# EAGLE design fc_rocket (EAGLE 9.2.2)
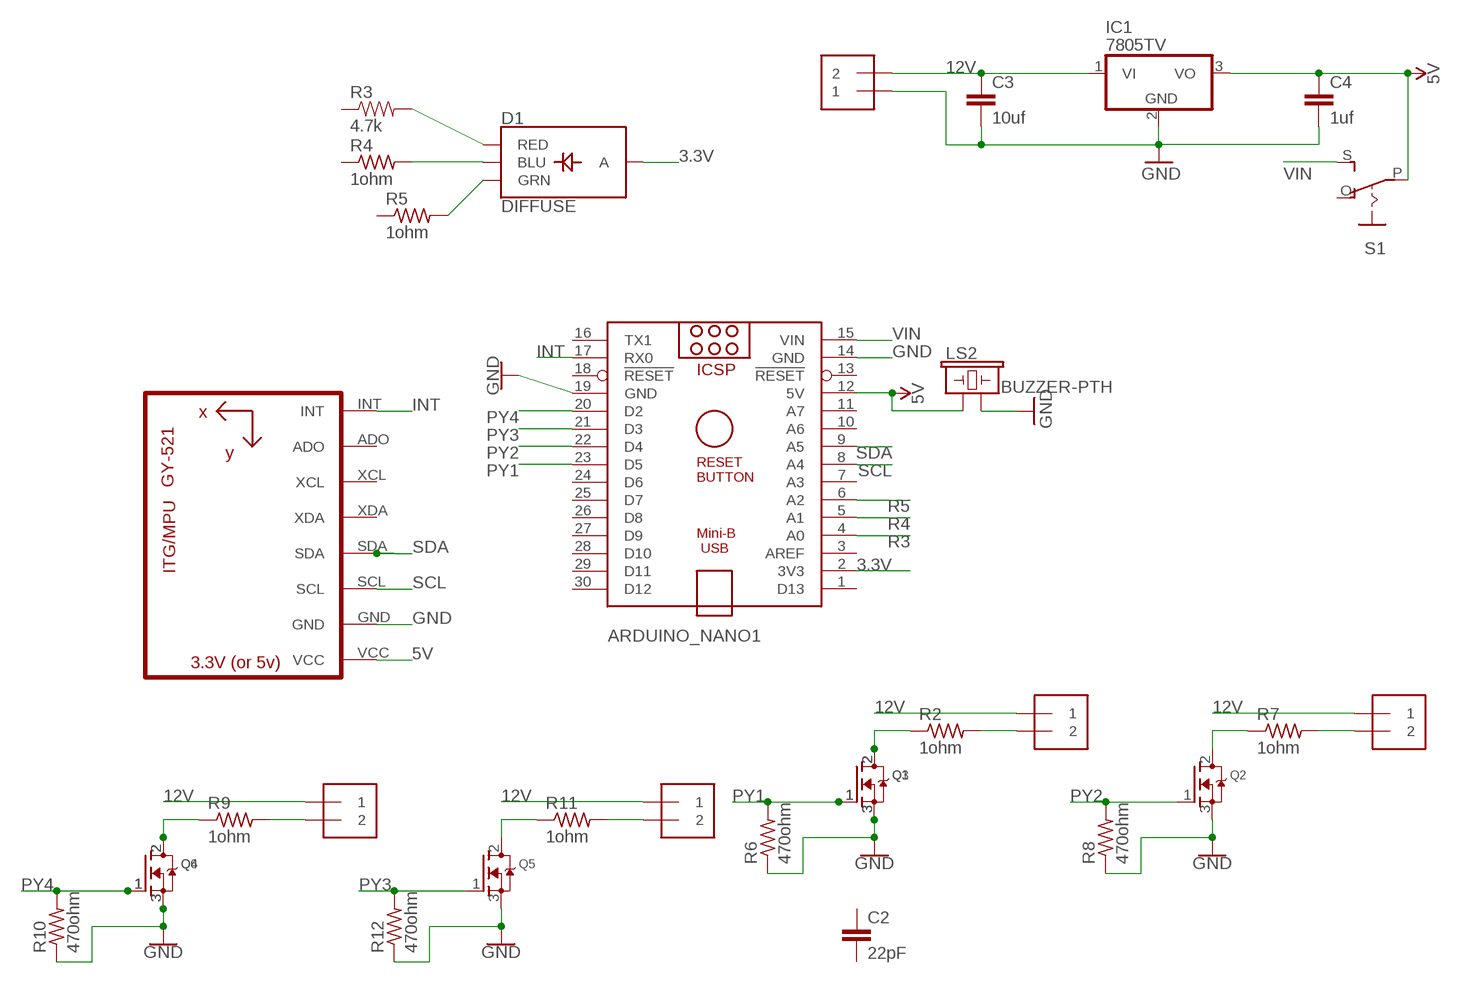
[diagram p0: schematic, sheet 1]

## Parts
ARDUINO_NANO1  ARDUINO_NANO  [ARDUINO_NANO]
C2  22pF  22PF-PTH-2.54MM-200V-5%  [CAP-PTH-2.54]
C3  10uf  22PF-PTH-2.54MM-200V-5%  [CAP-PTH-2.54]
C4  1uf  22PF-PTH-2.54MM-200V-5%  [CAP-PTH-2.54]
D1  DIFFUSE  LED-RGB-CADIFFUSE  [LED-RGB-THRU]
IC1  7805TV  [TO220V]
J2  1X2-3.5MM  [1X2-3.5MM]
J3  1X2-3.5MM  [1X2-3.5MM]
J4  1X2-3.5MM  [1X2-3.5MM]
J5  1X2-3.5MM  [1X2-3.5MM]
J6  1X2-3.5MM  [1X2-3.5MM]
LS2  BUZZER-PTH  [BUZZER-12MM]
Q1  MOSFET-NGDS_TO220V  [TO220V]
Q2  MOSFET-NGDS_TO220V  [TO220V]
Q3  MOSFET-NGDS_TO220V  [TO220V]
Q4  MOSFET-NGDS_TO220V  [TO220V]
Q5  MOSFET-NGDS_TO220V  [TO220V]
Q6  MOSFET-NGDS_TO220V  [TO220V]
R2  1ohm  FLIPFLOP-RES  [0805-THM]
R3  4.7k  4.7KOHM-0603-1/10W-1%  [0603]
R4  1ohm  FLIPFLOP-RES  [0805-THM]
R5  1ohm  FLIPFLOP-RES  [0805-THM]
R6  470ohm  FLIPFLOP-RES  [0805-THM]
R7  1ohm  FLIPFLOP-RES  [0805-THM]
R8  470ohm  FLIPFLOP-RES  [0805-THM]
R9  1ohm  FLIPFLOP-RES  [0805-THM]
R10  470ohm  FLIPFLOP-RES  [0805-THM]
R11  1ohm  FLIPFLOP-RES  [0805-THM]
R12  470ohm  FLIPFLOP-RES  [0805-THM]
S1  EG1218S  [EG1218]
U2  GY-521MPU6050  [GY-521]

## Nets
3.3V: ARDUINO_NANO1.2(3V3) D1.2(A)
5V: ARDUINO_NANO1.12(5V) C4.1 IC1.3(VO) LS2.+ S1.P U2.VCC
12V: C3.1 IC1.1(VI) J2.2 J3.1 J4.1 J5.1 J6.1
GND: ARDUINO_NANO1.14(GND) ARDUINO_NANO1.19(GND) C3.2 C4.2 IC1.2(GND) J2.1 LS2.- Q1.3(S) Q2.3(S) Q3.3(S) Q4.3(S) Q5.3(S) Q6.3(S) R6.1 R8.1 R10.1 R12.1 U2.GND
INT: ARDUINO_NANO1.17(RX0) U2.INT
N$2: D1.1(RED) R3.2
N$3: D1.4(BLU) R4.2
N$4: D1.3(GRN) R5.2
N$6: J3.2 R2.2
N$7: Q1.2(D) Q3.2(D) R2.1
N$8: J4.2 R7.2
N$9: Q2.2(D) R7.1
N$10: J5.2 R9.2
N$11: Q4.2(D) Q6.2(D) R9.1
N$12: J6.2 R11.2
N$13: Q5.2(D) R11.1
PY1: ARDUINO_NANO1.23(D5) Q1.1(G) Q3.1(G) R6.2
PY2: ARDUINO_NANO1.22(D4) Q2.1(G) R8.2
PY3: ARDUINO_NANO1.21(D3) Q5.1(G) R12.2
PY4: ARDUINO_NANO1.20(D2) Q4.1(G) Q6.1(G) R10.2
R3: ARDUINO_NANO1.4(A0)
R4: ARDUINO_NANO1.5(A1)
R5: ARDUINO_NANO1.6(A2)
SCL: ARDUINO_NANO1.8(A4) U2.SCL
SDA: ARDUINO_NANO1.9(A5) U2.SDA
VIN: ARDUINO_NANO1.15(VIN) S1.S
Unconnected: ARDUINO_NANO1.1(D13) ARDUINO_NANO1.3(AREF) ARDUINO_NANO1.7(A3) ARDUINO_NANO1.10(A6) ARDUINO_NANO1.11(A7) ARDUINO_NANO1.13(!RESET) ARDUINO_NANO1.16(TX1) ARDUINO_NANO1.18(!RESET) ARDUINO_NANO1.24(D6) ARDUINO_NANO1.25(D7) ARDUINO_NANO1.26(D8) ARDUINO_NANO1.27(D9) ARDUINO_NANO1.28(D10) ARDUINO_NANO1.29(D11) ARDUINO_NANO1.30(D12) C2.1 C2.2 R3.1 R4.1 R5.1 S1.O U2.ADO U2.XCL U2.XDA

## Library data of the parts
ARDUINO_NANO1 = ArduinoNanoV30:ARDUINO_NANO: Arduino Nano V3.0 Overview: The Arduino Nano is a small, complete, and breadboard-friendly board based on the ATmega328 (Arduino Nano 3.x) or ATmega168 (Arduino Nano 2.x). It has more or less the same functionality of the Arduino Duemilanove, but in a different package. It lacks only a DC power jack, and works with a Mini-B USB cable instead of a standard one. The Nano was designed and is being produced by Gravitech. Specifications: Microcontroller Atmel ATmega168 or ATmega328 Operating Voltage (logic level) 5 V Input Voltage (recommended) 7-12 V Input Voltage (limits) 6-20 V Digital I/O Pins 14 (of which 6 provide PWM output) Analog Input Pins 8 DC Current per I/O Pin 40 mA Flash Memory 16 KB (ATmega168) or 32 KB (ATmega328) of which 2 KB used by bootloader SRAM 1 KB (ATmega168) or 2 KB (ATmega328) EEPROM 512 bytes (ATmega168) or 1 KB (ATmega328) Clock Speed 16 MHz Dimensions 0.73" x 1.70" Length 45 mm Width 18 mm Weigth 5 g Power: The Arduino Nano can be powered via the Mini-B USB connection, 6-20V unregulated external power supply (pin 30), or 5V regulated external power supply (pin 27). The power source is automatically selected to the highest voltage source. Memory: The ATmega168 has 16 KB of flash memory for storing code (of which 2 KB is used for the bootloader); the ATmega328 has 32 KB, (also with 2 KB used for the bootloader). The ATmega168 has 1 KB of SRAM and 512 bytes of EEPROM (which can be read and written with the EEPROM library); the ATmega328 has 2 KB of SRAM and 1 KB of EEPROM. Input and Output: Each of the 14 digital pins on the Nano can be used as an input or output, using pinMode(), digitalWrite(), and digitalRead() functions. They operate at 5 volts. Each pin can provide or receive a maximum of 40 mA and has an internal pull-up resistor (disconnected by default) of 20-50 kOhms. In addition, some pins have specialized functions. Visit Arduino - ArduinoBoardNano <https://www.arduino.cc/en/Main/ArduinoBoardNano>
C2 = SparkFun-Capacitors:22PF: 22pF ceramic capacitors A capacitor is a passive two-terminal electrical component used to store electrical energy temporarily in an electric field.; PROD_ID: CAP-09128
C3 C4 = SparkFun-Capacitors:22PF: 22pF ceramic capacitors A capacitor is a passive two-terminal electrical component used to store electrical energy temporarily in an electric field.; PROD_ID: CAP-09128; VALUE: 22pF
D1 = SparkFun-LED:LED-RGB-CA: LED-RGB Diffused Common Anode Packages: LED RGB-THRU P-LCC-4-3 LED-TRICOLOR-SMD SparkFun Products: RGB Diffused Common Anode- Diffuse <[https://www.sparkfun.com/products/10821]> RGB Diffused Common Anode - Clear <[https://www.sparkfun.com/products/10820]> Qduino Mini <[https://www.sparkfun.com/products/13614]> Triple Output LED RGB - SMD <https://www.sparkfun.com/products/7844>; PROD_ID: DIO-10632
IC1 = linear:78*: Positive VOLTAGE REGULATOR Source: http://cache.national.com/ds/LM/LM78L05.pdf http://www.fairchildsemi.com/ds/LM/LM7805.pdf
J2-J6 = adafruit:1X2: 3.5mm Terminal block http://www.ladyada.net/library/pcb/eaglelibrary.html
LS2 = SparkFun-Electromechanical:BUZZER: Buzzer Small round buzzers that operate around the audible 2kHz range. You can use these as speakers to create simple music or user interfaces. Variant Overview: PTH - Mini Speaker - PC Mount 12mm 2.048kHz <https://www.sparkfun.com/products/7950> PTH_KIT - Mini Speaker - PC Mount 12mm 2.048kHz <https://www.sparkfun.com/products/7950> KIT simplifies soldering by adding stop mask to one side of the pads. PTH_NO_SILK - Mini Speaker - PC Mount 12mm 2.048kHz <https://www.sparkfun.com/products/7950> No silkscreen indicator of buzzer outline. PTH_KIT_NO_SILK - Mini Speaker - PC Mount 12mm 2.048kHz <https://www.sparkfun.com/products/7950> KIT package w/o silkscreen SMD - Buzzer Audio Magnetic (CCV-084B16) SMD buzzer used on, e.g. the LilyPad Buzzer <https://www.sparkfun.com/products/8463> and RFID USB Reader <https://www.sparkfun.com/products/9963>. SMD_KIT - Buzzer Audio Magnetic (CCV-084B16) SMD Buzzer with elongated pins to make soldering easier. Used on the SparkFun Simon Says - Surface Mount Soldering Kit <https://www.sparkfun.com/products/10935>.; PROD_ID: COMP-08253; SF_SKU: COM-07950
Q1-Q6 = adafruit:MOSFET-N: N-Channel Mosfet 2N7002E - 60V 260mA SOT23 [Digikey: 2N7002ET1GOSTR-ND] - REEL BSH103 - 30V 850mA SOT23 [Digikey: 568-5013-1-ND]
R2 R4-R12 = adafruit:FLIPFLOP-RES: Flip Flop resistor An 0805 resistor inside a standard 1/4W 5% resistor. Makes for easy mods
R3 = SparkFun-Resistors:4.7KOHM: 4.7kΩ resistor A resistor is a passive two-terminal electrical component that implements electrical resistance as a circuit element. Resistors act to reduce current flow, and, at the same time, act to lower voltage levels within circuits. - Wikipedia; PROD_ID: RES-07857
S1 = adafruit:EG1218: SLIDING SWITCH 0.1" spacing through hole, vertical SPDT slide switch http://www.ladyada.net/library/pcb/eaglelibrary.html
U2 = gy-521:GY-521

## Board
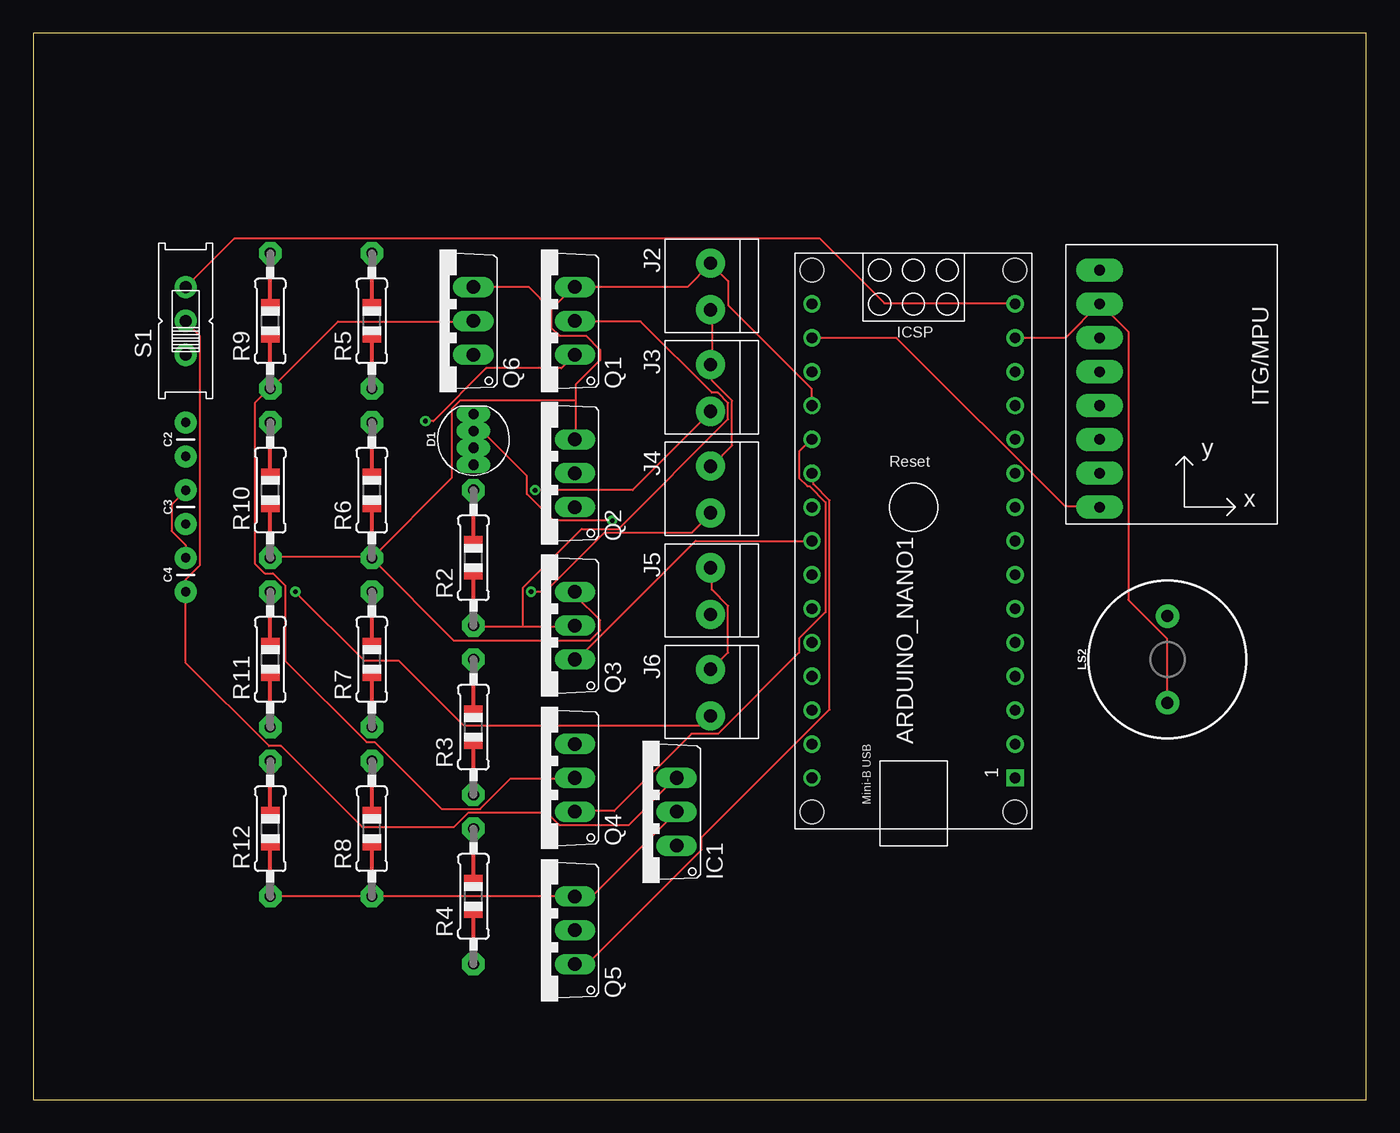
[diagram p1: board, top side]
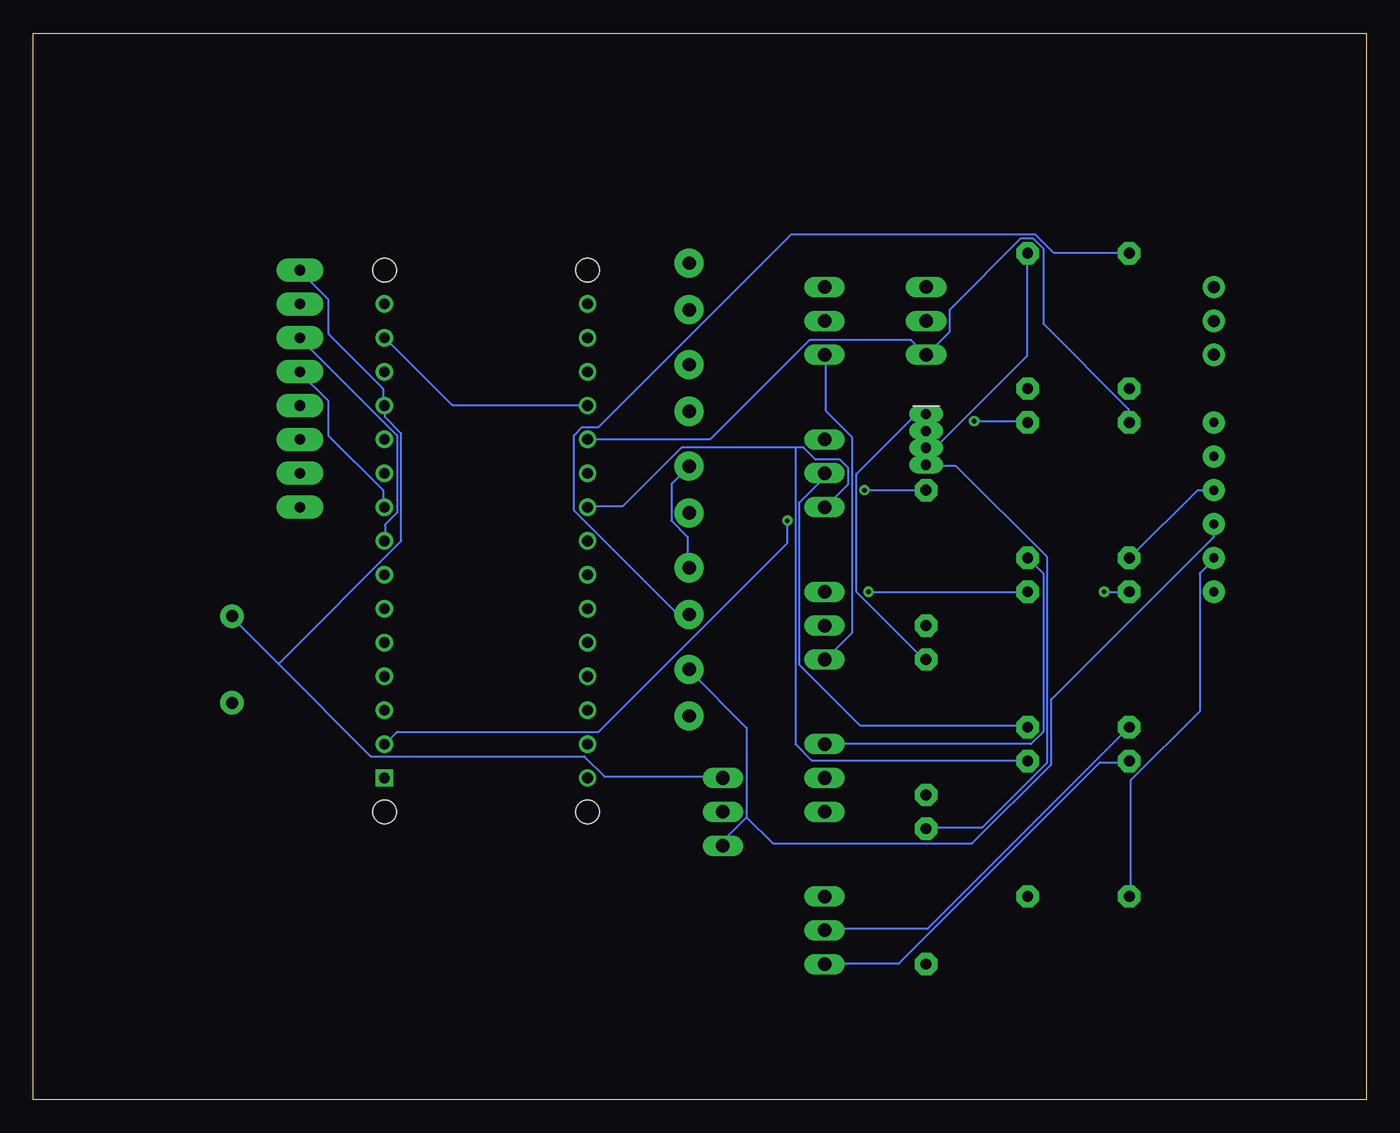
[diagram p2: board, bottom side, seen from below]

Size 100 x 80 mm. Coordinates in mm from the lower left corner, seen from the top.
Outline: 0,0 100,0 100,80 0,80 0,0
Copper layers (1*16): Top 0.035mm / dielectric 1.5mm / Bottom 0.035mm
Design rules "default": minimum track width 6mil, minimum drill 0.35mm, track to track 6mil, track to pad 6mil, pad to pad 6mil, via to via 6mil, smd to smd 6mil, copper to edge 40mil, drill to drill 6mil, minimum pad ring 10mil, minimum via ring 8mil, stop-mask expansion 4mil, vias tented up to drill 0mil, thermal gap 10mil

### Footprints (pad centres in the part's own frame; a part is rotated, then mirrored left to right if it is on the bottom)
ARDUINO_NANO = drill 0.8 square: 1 -20.32,-7.62 | drill 0.8: 2 -17.78,-7.62; 3 -15.24,-7.62; 4 -12.7,-7.62; 5 -10.16,-7.62; 6 -7.62,-7.62; 7 -5.08,-7.62; 8 -2.54,-7.62; 9 0,-7.62; 10 2.54,-7.62; 11 5.08,-7.62; 12 7.62,-7.62; 13 10.16,-7.62; 14 12.7,-7.62; 15 15.24,-7.62; 16 15.24,7.62; 17 12.7,7.62; 18 10.16,7.62; 19 7.62,7.62; 20 5.08,7.62; 21 2.54,7.62; 22 0,7.62; 23 -2.54,7.62; 24 -5.08,7.62; 25 -7.62,7.62; 26 -10.16,7.62; 27 -12.7,7.62; 28 -15.24,7.62; 29 -17.78,7.62; 30 -20.32,7.62 | hole 1.778: -22.86,-7.62; -22.86,7.62; 17.78,7.62; 17.78,-7.62
CAP-PTH-2.54 = drill 0.7 pad 1.651: 1 -1.27,0; 2 1.27,0
LED-RGB-THRU = drill 0.762 pad 0.889 long: 1 1.905,0; 2 0.635,0; 3 -0.635,0; 4 -1.905,0
TO220V = drill 1.016 long: 1 -2.54,-2.54; 2 0,-2.54; 3 2.54,-2.54
1X2-3.5MM = drill 1 pad 2.184: 1 1.8,0; 2 -1.7,0
BUZZER-12MM = drill 0.9 pad 1.778: + 3.25,0; - -3.25,0
0805-THM = drill 0.813 pad 1.676 octagon: 1 -5.08,0; 2 5.08,0
EG1218 = drill 0.9 pad 1.676: O -2.54,0; P 0,0; S 2.54,0
GY-521 = drill 0.8 pad 1.778 long: ADO -8.89,-6.35; GND -8.89,6.35; INT -8.89,-8.89; SCL -8.89,3.81; SDA -8.89,1.27; VCC -8.89,8.89; XCL -8.89,-3.81; XDA -8.89,-1.27

### Placement (x,y rotation side)
ARDUINO_NANO1  66.04,44.45 90 top
C2  11.43,49.53 90 top
C3  11.43,44.45 90 top
C4  11.43,39.37 90 top
D1  33.02,49.53 90 top
IC1  45.72,21.59 90 top
J2  50.8,60.96 90 top
J3  50.8,53.34 90 top
J4  50.8,45.72 90 top
J5  50.8,38.1 90 top
J6  50.8,30.48 90 top
LS2  85.09,33.02 90 top
Q1  38.1,58.42 90 top
Q2  38.1,46.99 90 top
Q3  38.1,35.56 90 top
Q4  38.1,24.13 90 top
Q5  38.1,12.7 90 top
Q6  30.48,58.42 90 top
R2  33.02,40.64 90 top
R3  40ohm  [0805-THM]  33.02,27.94 90 top
R4  33.02,15.24 90 top
R5  25.4,58.42 90 top
R6  25.4,45.72 90 top
R7  25.4,33.02 90 top
R8  25.4,20.32 90 top
R9  17.78,58.42 90 top
R10  17.78,45.72 90 top
R11  17.78,33.02 90 top
R12  17.78,20.32 90 top
S1  11.43,58.42 90 top
U2  88.9,53.34 0 top

### Tracks (layer width: path | path; a pad name or v marks a point on that pad's centre or on a via)
3.3V  (via drill 0.35)
  Top 0.152: v43.43,43.43 39.01,43.43 37.03,45.41 37.03,46.79 33.68,50.14 33.07,50.14 D1.2
  Bottom 0.152: v43.43,43.43 43.43,41.76 57.61,27.58 72.69,27.58 73.61,26.67 ARDUINO_NANO1.2
5V
  Top 0.152: S1.P 11.43,58.37 12.5,57.3 12.5,40.08 11.43,39.01 C4.1 11.43,32.77 17.68,26.52 18.59,26.52 24.69,20.42 31.55,20.42 32.61,21.49 38.56,21.49 39.47,20.57 44.65,20.57 48.16,24.08 IC1.3
  Bottom 0.152: U2.VCC 80.01,62.18 77.88,60.05 77.88,57.45 73.76,53.34 73.76,52.12 ARDUINO_NANO1.12 73.61,51.97 73.61,51.21 72.39,49.99 72.39,41.91 81.53,32.77 81.69,32.77 | 81.69,32.77 85.04,36.12 LS2.+ | 81.69,32.77 74.68,25.76 58.67,25.76 57.15,24.23 48.31,24.23 IC1.3
12V
  Top 0.152: J2.2 50.9,59.13 50.9,55.17 J3.1 50.9,55.02 50.9,53.95 52.43,52.43 52.43,49.07 50.9,47.55 J4.1 | J5.1 50.9,39.78 50.9,38.25 52.12,37.03 52.12,33.53 50.9,32.31 J6.1
  Bottom 0.152: J5.1 50.9,39.93 50.9,42.22 52.12,43.43 52.12,46.18 50.9,47.4 J4.1 | 46.48,21.18 48.16,19.51 48.16,19.05 IC1.1 | 46.48,21.18 46.48,27.89 50.75,32.16 J6.1 | C3.1 11.43,42.22 23.62,30.02 23.62,25.15 29.57,19.2 44.5,19.2 46.48,21.18
GND
  Top 0.152: R12.1 R8.1 Q5.3 41.91,15.24 IC1.2 | C4.2 11.43,41.6 10.36,42.67 10.36,44.65 C3.2 | Q3.3 40.69,38.1 40.69,37.8 42.52,35.97 42.52,35.2 41.76,34.44 31.55,34.44 25.45,40.54 R6.1 | R10.1 17.83,40.69 25.3,40.69 R6.1 | 40.69,52.43 40.69,53.65 42.52,55.47 42.52,56.24 41.45,57.3 39.47,57.3 38.86,57.91 38.86,59.28 | 40.69,52.43 40.69,49.53 Q2.3 | 38.86,59.28 40.54,60.96 Q1.3 49.07,60.96 50.75,62.64 J2.1 50.9,62.64 52.12,61.42 52.12,59.59 58.37,53.34 58.37,52.12 ARDUINO_NANO1.19 | Q6.3 37.19,60.96 38.86,59.28 | ARDUINO_NANO1.14 77.42,57.15 80.01,59.74 | 80.01,59.74 82.14,57.61 82.14,37.49 85.04,34.59 85.04,29.87 LS2.- | 80.01,59.74 U2.GND | R6.1 31.39,46.63 31.39,51.82 32,52.43 40.69,52.43
  Bottom 0.152: Q4.3 25.15,26.67 24.23,27.58 24.23,39.47 R6.1 | C3.2 12.65,45.72 17.68,40.69 R10.1 | R12.1 17.68,15.24 17.68,23.93 12.5,29.11 12.5,39.47 11.43,40.54 C4.2 | ARDUINO_NANO1.19 58.52,52.12 68.58,52.12 73.61,57.15 ARDUINO_NANO1.14
INT
  Top 0.152: ARDUINO_NANO1.17 64.77,57.15 77.42,44.5 80.01,44.5 U2.INT
N$2
  Bottom 0.152: D1.1 33.07,51.36 33.83,51.36 38.25,46.94 38.25,38.1 33.07,32.92 R3.2
N$3
  Bottom 0.152: D1.4 32.92,47.55 30.79,47.55 23.93,40.69 23.93,25.3 28.8,20.42 32.92,20.42 R4.2
N$4
  Bottom 0.152: D1.3 32.92,48.92 32.31,48.92 25.45,55.78 25.45,63.4 R5.2
N$6  (via drill 0.35)
  Top 0.152: v37.64,45.72 44.96,45.72 50.75,51.51 J3.2
  Bottom 0.152: v37.64,45.72 R2.2
N$7
  Top 0.152: 36.73,35.51 33.07,35.51 R2.1 | 36.73,35.51 40.54,35.51 Q3.2 | 36.73,35.51 36.73,38.41 41.15,42.82 43.89,42.82 52.12,51.05 52.12,52.27 51.36,53.03 50.9,53.03 45.57,58.37 40.69,58.37 Q1.2
N$8  (via drill 0.35)
  Top 0.152: v37.34,38.1 38.41,38.1 42.82,42.52 49.38,42.52 50.75,43.89 J4.2
  Bottom 0.152: v37.34,38.1 R7.2
N$9
  Bottom 0.152: Q2.2 40.69,46.94 40.69,46.63 42.52,44.81 42.52,32.61 37.95,28.04 25.45,28.04 R7.1
N$10
  Bottom 0.152: R9.2 17.83,63.55 23.47,63.55 24.84,64.92 43.13,64.92 57.61,50.44 58.83,50.44 59.44,49.84 59.44,44.2 51.66,36.42 50.9,36.42 J5.2
N$11
  Top 0.152: Q6.2 32.92,58.37 22.86,58.37 17.83,53.34 R9.1 17.68,53.34 16.61,52.27 16.61,40.23 17.37,39.47 17.98,39.47 18.9,38.56 18.9,32.92 24.99,26.82 25.6,26.82 30.63,21.79 33.53,21.79 35.81,24.08 40.54,24.08 Q4.2
N$12  (via drill 0.35)
  Top 0.152: v19.66,38.1 24.84,32.92 27.43,32.92 32.31,28.04 50.14,28.04 50.75,28.65 J6.2
  Bottom 0.152: v19.66,38.1 R11.2
N$13
  Bottom 0.152: R11.1 32.92,12.8 40.54,12.8 Q5.2
PY1  (via drill 0.35)
  Top 0.152: ARDUINO_NANO1.23 49.68,41.91 40.69,32.92 Q3.1 | v29.41,50.9 30.02,50.9 33.98,54.86 39.62,54.86 Q1.1
  Bottom 0.152: Q1.1 40.54,55.78 40.54,51.66 38.56,49.68 38.56,35.05 40.54,33.07 Q3.1 | v29.41,50.9 25.45,50.9 R6.2
PY2
  Bottom 0.152: 42.82,48.92 42.22,48.92 41.3,48.01 39.47,48.01 38.86,47.4 38.86,46.18 40.54,44.5 Q2.1 | 42.82,48.92 51.36,48.92 55.78,44.5 58.37,44.5 ARDUINO_NANO1.22 | 42.82,48.92 42.82,26.67 41.6,25.45 25.45,25.45 R8.2
PY3
  Top 0.152: ARDUINO_NANO1.21 58.52,46.94 58.52,46.18 59.74,44.96 59.74,29.26 50.14,19.66 50.14,18.75 41.6,10.21 40.69,10.21 Q5.1
  Bottom 0.152: R12.2 17.83,25.3 19.96,25.3 35.05,10.21 40.54,10.21 Q5.1
PY4
  Top 0.152: Q4.1 40.69,21.64 43.59,21.64 49.38,27.43 51.36,27.43 57.45,33.53 57.45,34.59 59.44,36.58 59.44,44.81 58.22,46.02 58.06,46.02 57.45,46.63 57.45,48.62 58.37,49.53 ARDUINO_NANO1.20
  Bottom 0.152: ARDUINO_NANO1.20 49.23,49.53 41.76,57 34.14,57 Q6.1 32.92,55.93 31.24,57.61 31.24,59.28 25.91,64.62 24.99,64.62 24.23,63.86 24.23,58.22 17.83,51.82 17.83,50.9 R10.2
SCL
  Bottom 0.152: U2.SCL 72.69,49.84 72.69,44.04 73.61,43.13 73.61,41.91 ARDUINO_NANO1.8
SDA
  Bottom 0.152: ARDUINO_NANO1.9 73.76,44.5 73.76,45.72 77.88,49.84 77.88,52.43 80.01,54.56 U2.SDA
VIN
  Top 0.152: S1.S 15.09,64.62 58.98,64.62 63.86,59.74 73.61,59.74 ARDUINO_NANO1.15